# EAGLE design ble_test_1 (EAGLE 7.5.0)
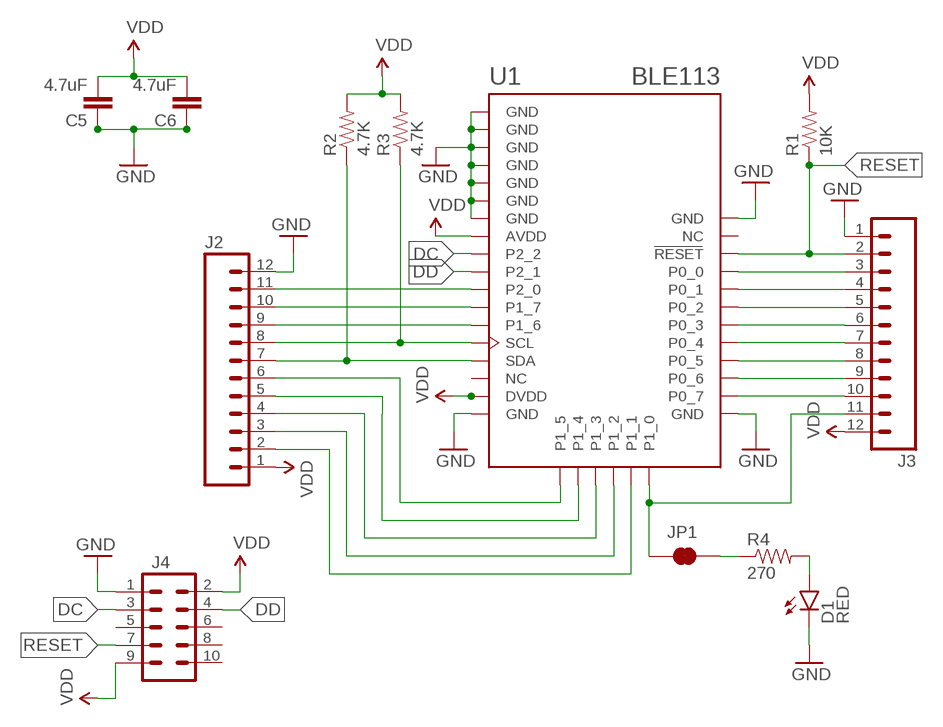
[diagram p0: schematic, sheet 1]

## Parts
C5  4.7uF  CAP0603-CAP  [0603-CAP]
C6  4.7uF  CAP0603-CAP  [0603-CAP]
D1  RED  LED-RED0603  [LED-0603]
J2  M12PTH  [1X12]
J3  M12PTH  [1X12]
J4  M05X2PTH  [AVR_ICSP]
JP1  JUMPER-PAD-2-NC_BY_TRACE  [PAD-JUMPER-2-NC_BY_TRACE_YES_SILK]
R1  10K  RESISTOR0603-RES  [0603-RES]
R2  4.7K  RESISTOR0603-RES  [0603-RES]
R3  4.7K  RESISTOR0603-RES  [0603-RES]
R4  270  RESISTOR0603-RES  [0603-RES]
U1  BLE113  BLE113-VISUAL-A  [BLE113-A]

## Nets
DC: J4.3 U1.P2_2
DD: J4.4 U1.P2_1
GND: C5.1 C6.1 D1.C J2.12 J3.1 J4.1 U1.GND U1.GND@2(GND) U1.GND@3(GND) U1.GND@4(GND) U1.GND@5(GND) U1.GND@6(GND) U1.GND@7(GND) U1.GND@8(GND) U1.GND@9(GND) U1.GND@10(GND)
N$1: J3.8 U1.P0_5
N$2: J2.11 U1.P2_0
N$3: J3.7 U1.P0_4
N$4: J3.4 U1.P0_1
N$5: J2.10 U1.P1_7
N$6: J3.5 U1.P0_2
N$7: J3.6 U1.P0_3
N$8: J3.10 U1.P0_7
N$9: J3.9 U1.P0_6
N$10: J2.2 U1.P1_1
N$11: D1.A R4.2
N$12: J3.3 U1.P0_0
N$13: J3.11 JP1.1 U1.P1_0
N$14: J2.9 U1.P1_6
N$15: J2.6 U1.P1_5
N$16: JP1.2 R4.1
N$17: J2.5 U1.P1_4
N$18: J2.3 U1.P1_2
N$26: J2.4 U1.P1_3
RESET: J3.2 J4.7 R1.1 U1.RESET
SCL: J2.7 R2.1 U1.SDA
SDA: J2.8 R3.1 U1.SCL
VDD: C5.2 C6.2 J2.1 J3.12 J4.2 J4.9 R1.2 R2.2 R3.2 U1.AVDD U1.DVDD
Unconnected: J4.5 J4.6 J4.8 J4.10 U1.NC U1.NC@2(NC)

## Library data of the parts
C5 C6 = SparkFun-Passives:CAP: Capacitor Standard 0603 ceramic capacitor, and 0.1" leaded capacitor.
D1 = SparkFun-LED:LED-RED: Assorted Red LEDs LilyPad 1206- DIO-09912 1206- DIO-00809 0603- DIO-00819 "SMART" means more efficient and expensive; PROD_ID: DIO-00819
J2 J3 = SparkFun-Connectors:M12: Header 12 Standard 12-pin 0.1" header. Use with straight break away headers (SKU : PRT-00116), right angle break away headers (PRT-00553), swiss pins (PRT-00743), machine pins (PRT-00117), and female headers (PRT-00115).
J4 = SparkFun-Connectors:M05X2: Header 5x2 Standard 10-pin dual row 0.1" header. Commonly used with AVR-ISP. Use with Spark Fun Electronics SKU: PRT-00778
JP1 = SparkFun-Passives:JUMPER-PAD-2-NC_BY_TRACE
R1-R4 = SparkFun-Passives:RESISTOR: Resistor Basic schematic elements and footprints for 0603, 1206, and PTH resistors.
U1 = sf-bluegiga:BLE113-VISUAL: Bluetooth Low Energy single-mode module - Bluetooth 4.0 (CC2541). BLE113-A variant has an on-module ceramic chip antenna. BLE113-A variant includes keepout/restrict area. Antenna edge of the module should be flush up against the edge of the PCB. See datasheet for variant layout details. The BLE113 is a Bluetooth Smart module targeted for small and low-power sensors and accessories. It integrates all features required for a Bluetooth Smart application, including Bluetooth radio, software stack, and GATT-based profiles. The BLE113 Bluetooth Smart module can also host end-user applications, which means no external micro controller is required in size or price constrained devices. Moreover, it has flexible hardware interfaces to connect to different peripherals and sensors and can be powered directly from a standard 3V coin cell battery or a pair of AAA batteries. In the lowest power sleep mode it merely consumes 500 nA and will wake up within a few hundred microseconds. The BLE113 Bluetooth Smart module conusmer approximately 30% less power and is smaller than the BLE112 Bluetooth Smart Module. http://www.bluegiga.com/en-US/products/bluetooth-4.0-modules/ble113-bluetooth--smart-module https://github.com/jrowberg/sf-oshw Last updated 2014-01-04 by Jeff Rowberg <jeff@rowberg.net>; ANTENNA: On-module ceramic chip antenna

## Board
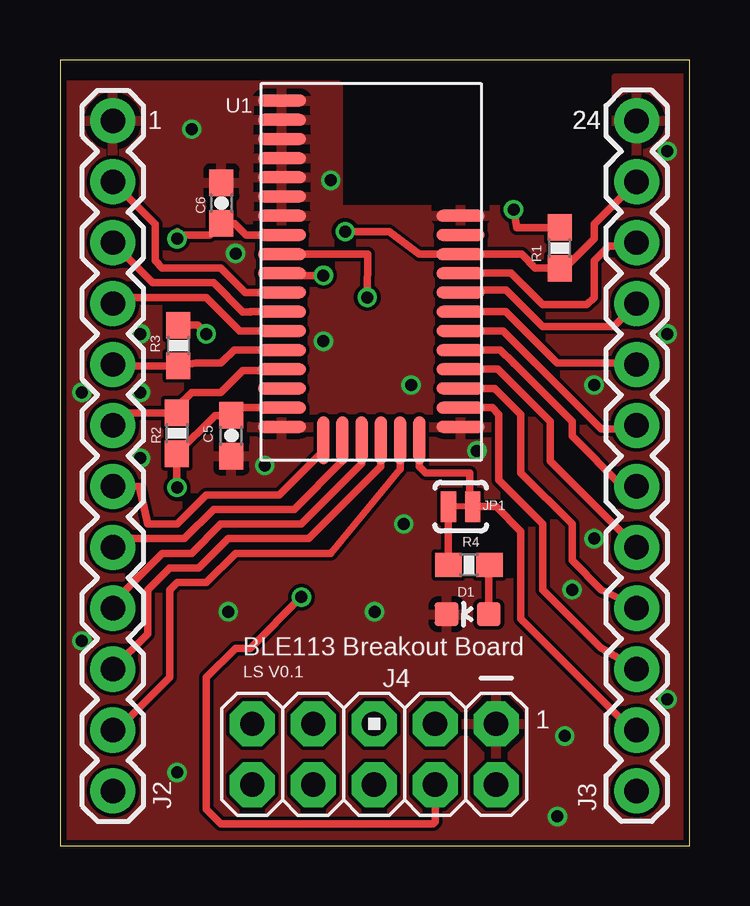
[diagram p1: board, top side]
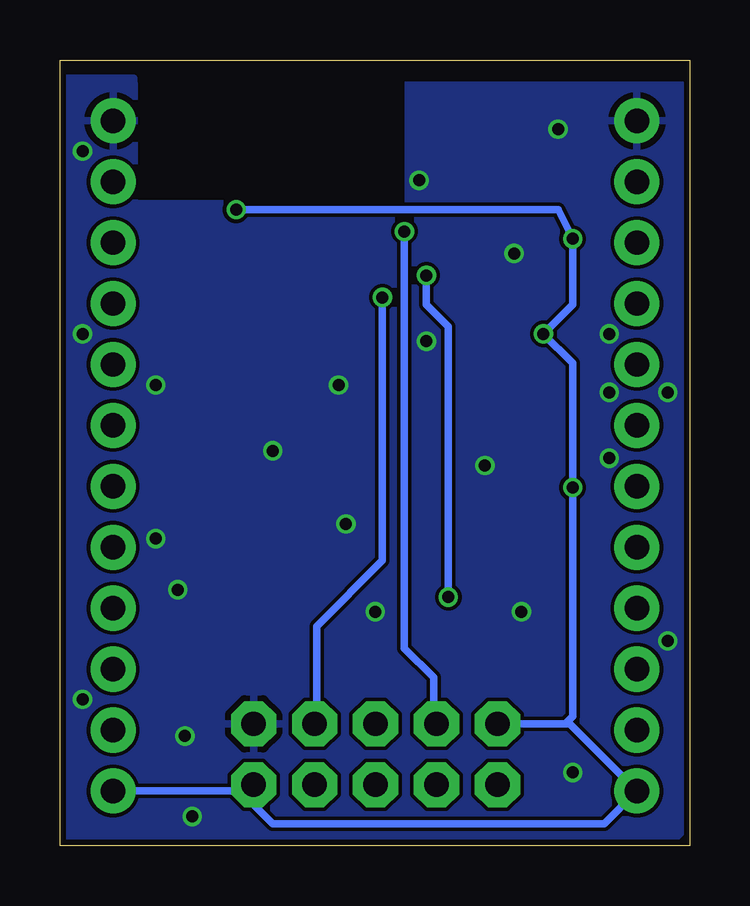
[diagram p2: board, bottom side, seen from below]

Size 26.24 x 32.76 mm. Coordinates in mm from the lower left corner, seen from the top.
Outline: 0,0 26.24,0 26.24,32.76 0,32.76 0,0
Copper layers (1*16): Top 0.035mm / dielectric 1.5mm / Bottom 0.035mm
Design rules "SeeedStudio_2layer_DRU_no_angle_20140221": minimum track width 6mil, minimum drill 12mil, track to track 6mil, track to pad 6mil, pad to pad 6mil, via to via 6mil, smd to smd 0mil, copper to edge 10mil, drill to drill 10mil, minimum pad ring 10mil, minimum via ring 6mil, stop-mask expansion 2mil, vias tented up to drill 100mil, thermal gap 10mil

### Footprints (pad centres in the part's own frame; a part is rotated, then mirrored left to right if it is on the bottom)
0603-CAP = smd 1.1 x 1: 1 -0.85,0; 2 0.85,0
LED-0603 = smd 1 x 1: A 0,-0.877; C 0,0.877
1X12 = drill 1.016 pad 1.88: 1 0,0; 2 2.54,0; 3 5.08,0; 4 7.62,0; 5 10.16,0; 6 12.7,0; 7 15.24,0; 8 17.78,0; 9 20.32,0; 10 22.86,0; 11 25.4,0; 12 27.94,0
AVR_ICSP = drill 1.016 pad 1.88 octagon: 1 -1.27,5.08; 2 1.27,5.08; 3 -1.27,2.54; 4 1.27,2.54; 5 -1.27,0; 6 1.27,0; 7 -1.27,-2.54; 8 1.27,-2.54; 9 -1.27,-5.08; 10 1.27,-5.08
PAD-JUMPER-2-NC_BY_TRACE_YES_SILK = smd 0.635 x 1.27: 1 -0.508,0; 2 0.508,0
0603-RES = smd 1.1 x 1: 1 -0.85,0; 2 0.85,0
BLE113-A = smd 2 x 0.5: AVDD -3.725,1.538; DVDD -3.725,-5.662; GND -3.725,7.138; GND@2 -3.725,6.338; GND@3 -3.725,5.537; GND@4 -3.725,4.737; GND@5 -3.725,3.938; GND@6 -3.725,3.138; GND@7 -3.725,2.337; GND@8 -3.725,-6.463; GND@9 3.725,-6.463; GND@10 3.725,2.337; NC -3.725,-4.862; NC@2 3.725,1.538; P0_0 3.725,-0.062; P0_1 3.725,-0.863; P0_2 3.725,-1.663; P0_3 3.725,-2.462; P0_4 3.725,-3.263; P0_5 3.725,-4.062; P0_6 3.725,-4.862; P0_7 3.725,-5.662; P1_6 -3.725,-2.462; P1_7 -3.725,-1.663; P2_0 -3.725,-0.863; P2_1 -3.725,-0.062; P2_2 -3.725,0.738; RESET 3.725,0.738; SCL -3.725,-3.263; SDA -3.725,-4.062 | smd 0.5 x 2: P1_0 2,-7.013; P1_1 1.2,-7.013; P1_2 0.4,-7.013; P1_3 -0.4,-7.013; P1_4 -1.2,-7.013; P1_5 -2,-7.013

### Placement (x,y rotation side)
C5  7.14,17.09 90 top
C6  6.72,26.79 270 top
D1  16.99,9.65 90 top
J2  2.2,2.28 90 top
J3  24.03,30.22 270 top
J4  13.09,3.81 270 top
JP1  16.7,14.13 180 top
R1  20.82,24.92 90 top
R2  4.87,17.19 270 top
R3  4.94,20.85 90 top
R4  17.04,11.7 0 top
U1  12.97,23.92 0 top

### Tracks (layer width: path | path; a pad name or v marks a point on that pad's centre or on a via)
DC  (via drill 0.5)
  Top 0.305: U1.P2_2 12.83,24.66 v12.8,22.86
  Bottom 0.305: v12.8,22.86 12.8,11.89 15.54,9.14 15.54,5.17 J4.3
DD  (via drill 0.5)
  Top 0.305: J4.4 15.63,1 15.54,0.91 6.71,0.91 6.1,1.52 6.1,7.01 7.32,8.23 7.92,8.23 v10.06,10.36 | v10.97,23.77 9.33,23.77 U1.P2_1
  Bottom 0.305: v10.06,10.36 10.06,21.64 10.97,22.56 v10.97,23.77
GND  (via drill 0.5)
  other vias: 8.53,15.85 21.34,10.67 22.25,12.8 22.25,19.2 5.49,29.87 11.28,27.74 17.37,16.46 14.63,19.2 10.97,21.03 14.33,13.41 7.01,9.75 21.03,4.57 13.11,9.75 4.88,3.05 20.73,1.22 25.3,6.1 3.35,21.34 3.35,16.15 3.35,18.9 7.32,24.69 0.91,8.53 0.91,18.9 25.3,21.34 25.3,28.96
  pour Top: -1.22,31.7 11.58,31.7 11.58,26.52 22.86,26.52 23.16,32 28.65,32 28.65,-1.22 -1.22,-1.22
  pour Bottom: 0.3,31.7 11.89,31.7 11.89,26.82 22.86,26.82 23.16,32 26.52,32 26.52,0.3 0.61,0.3 0.3,0.61
N$1
  Top 0.305: U1.P0_5 18.24,19.86 20.42,17.68 20.42,16.04 J3.8
N$2
  Top 0.305: U1.P2_0 7.72,23.06 6.71,24.08 4.27,24.08 3.96,24.38 3.96,25.92 J2.11
N$3
  Top 0.305: U1.P0_4 18.35,20.66 18.9,20.12 | 18.9,20.12 18.9,20.11 | J3.7 23.42,14.98 21.34,17.07 21.34,17.68 18.9,20.12
N$4
  Top 0.305: U1.P0_1 16.8,23.16 18.59,23.16 20.12,21.64 23.07,21.64 J3.4
N$5
  Top 0.305: U1.P1_7 7.94,22.26 7.92,22.25 7.62,22.25 6.4,23.47 3.87,23.47 J2.10 2.65,24.69
N$6
  Top 0.305: U1.P0_2 18.58,22.26 20.73,20.12 23.97,20.12 J3.5
N$7
  Top 0.305: U1.P0_3 18.47,21.46 22.56,17.37 23.88,17.37 J3.6
N$8
  Top 0.305: U1.P0_7 18.01,18.26 18.29,17.98 18.29,15.24 20.12,13.41 20.12,10.67 22.51,8.27 J3.10
N$9
  Top 0.305: U1.P0_6 18.12,19.06 19.2,17.98 19.2,15.54 21.34,13.41 21.34,11.89 22.56,10.67 23.87,10.06 J3.9
N$10
  Top 0.305: U1.P1_1 14.17,15.69 11.28,12.19 7.32,12.19 6.1,10.97 4.88,10.97 4.57,10.67 4.57,7.01 2.38,4.82 J2.2
N$11
  Top 0.305: D1.A 17.86,11.67 R4.2
N$12
  Top 0.305: U1.P0_0 18.81,23.86 20.12,22.56 21.95,22.56 22.25,22.86 22.25,24.38 22.86,24.99 23.88,24.99 J3.3
N$13
  Top 0.305: J3.11 23.83,4.82 19.2,9.45 19.2,13.11 18.18,14.13 JP1.1 17.07,14.27 17.07,15.54 15.24,15.54 14.97,15.81 U1.P1_0
N$14
  Top 0.305: U1.P1_6 7.49,21.46 6.1,22.86 2.46,22.86 J2.9
N$15
  Top 0.305: J2.6 3.31,14.98 3.66,13.41 4.88,13.41 6.1,14.63 9.14,14.63 10.97,16.46 U1.P1_5
N$16
  Top 0.305: R4.1 JP1.2
N$17
  Top 0.305: U1.P1_4 11.77,16.04 9.75,14.02 6.4,14.02 5.18,12.8 2.56,12.8 J2.5
N$18
  Top 0.305: U1.P1_2 13.37,15.81 10.36,12.8 7.01,12.8 5.79,11.58 4.57,11.58 3.66,10.67 3.66,8.84 2.2,7.38 J2.3
N$26
  Top 0.305: U1.P1_3 12.57,15.92 10.06,13.41 6.71,13.41 5.49,12.19 4.27,12.19 2.2,10.13 J2.4
RESET  (via drill 0.5)
  Top 0.305: J3.2 22.25,25.91 22.25,25.3 21.02,24.07 R1.1 19.81,24.08 19.23,24.66 U1.RESET 14.96,24.66 13.72,25.6 v11.89,25.6
  Bottom 0.305: v11.89,25.6 11.89,8.23 10.67,7.01 10.67,5.2 J4.7
SCL
  Top 0.305: J2.7 2.72,18.04 R2.1 4.87,18.28 5.49,18.9 6.71,18.9 7.62,19.81 9.2,19.81 U1.SDA
SDA
  Top 0.305: U1.SCL 7.25,20.66 6.71,20.12 5.66,20.12 R3.1 2.26,20 J2.8
VDD  (via drill 0.5)
  Top 0.305: U1.DVDD 7.16,18.26 C5.2 6.47,17.94 R2.2 v4.87,14.94 v4.88,14.94 | v4.88,25.3 4.88,25.6 5.02,25.46 6.25,25.46 C6.2 7.29,25.94 7.76,25.46 U1.AVDD | R3.2 5.73,21.7 v6.1,21.34 | R1.2 19.04,25.77 v18.9,26.52
  Bottom 0.305: J4.9 5.18,5.08 | 5.18,5.08 5,5.08 J2.1 3.57,0.91 17.37,0.91 18.17,1.71 J4.2 18.43,2.28 J3.12 | 5.18,5.08 4.88,5.38 v4.88,14.94 4.88,20.12 v6.1,21.34 4.88,22.56 v4.88,25.3 5.49,26.52 v18.9,26.52

### Text on the board
tNames: 1 | 24 | 24 | BLE113 Breakout Board | LS V0.1 | 1